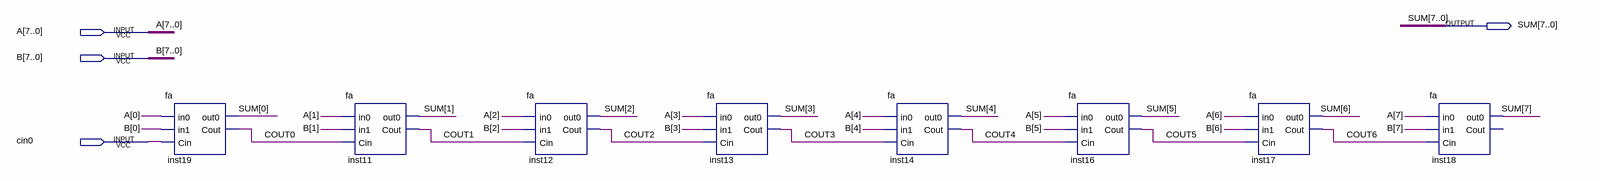
[diagram p0: schematic sheet]
// Quartus schematic rca.bdf as structural Verilog: 8 symbols, 4 pins
module rca (
  input  [7:0] A,
  input  [7:0] B,
  input  cin0,
  output [7:0] SUM
);

  wire COUT0, COUT1, COUT2, COUT3, COUT4, COUT5, COUT6;

  fa inst19 (.in0(A[0]), .in1(B[0]), .Cin(cin0), .out0(SUM[0]), .Cout(COUT0));
  fa inst11 (.in0(A[1]), .in1(B[1]), .Cin(COUT0), .out0(SUM[1]), .Cout(COUT1));
  fa inst12 (.in0(A[2]), .in1(B[2]), .Cin(COUT1), .out0(SUM[2]), .Cout(COUT2));
  fa inst13 (.in0(A[3]), .in1(B[3]), .Cin(COUT2), .out0(SUM[3]), .Cout(COUT3));
  fa inst14 (.in0(A[4]), .in1(B[4]), .Cin(COUT3), .out0(SUM[4]), .Cout(COUT4));
  fa inst16 (.in0(A[5]), .in1(B[5]), .Cin(COUT4), .out0(SUM[5]), .Cout(COUT5));
  fa inst17 (.in0(A[6]), .in1(B[6]), .Cin(COUT5), .out0(SUM[6]), .Cout(COUT6));
  fa inst18 (.in0(A[7]), .in1(B[7]), .Cin(COUT6), .out0(SUM[7]));  // open: Cout
endmodule
